# Altium project Al_robot.PrjPcb
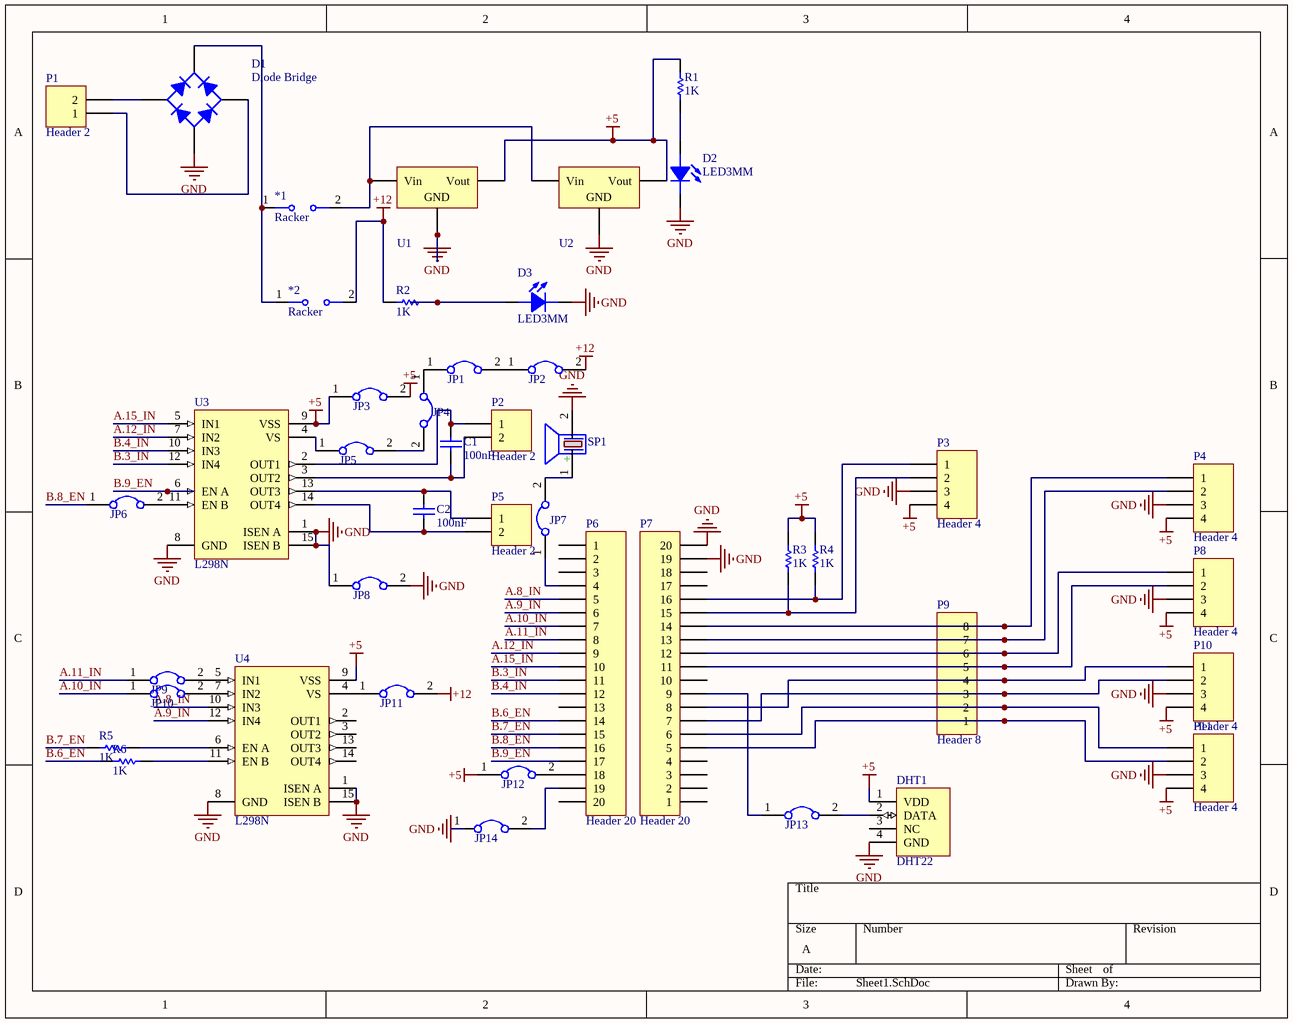
[diagram p0: Sheet1.SchDoc]
1 sheet, 44 parts. Net scope: global (net labels, ports and power ports of the same name join across sheets).
Board file: PCB1.PcbDoc

## Sheet Sheet1.SchDoc
size A; DocumentNumber: 1; SheetNumber: 1; SheetTotal: 1

### Parts
*1  Racker  [Racker 2 Pin]
*2  Racker  [Racker 2 Pin]
C1  100nF  [Cap-100nF]
C2  100nF  [Cap-100nF]
D1  Diode Bridge  [Bridge KBL PACKAGE]
D2  LED3MM  [LED3mm_GRN]
D3  LED3MM  [LED3mm_GRN]
DHT1  DHT22  [DHT22]
JP1  Jumper  [Jumper]  (value not drawn)
JP2  Jumper  [Jumper]  (value not drawn)
JP3  Jumper  [Jumper]  (value not drawn)
JP4  Jumper  [Jumper]  (value not drawn)
JP5  Jumper  [Jumper]  (value not drawn)
JP6  Jumper  [Jumper]  (value not drawn)
JP7  Jumper  [Jumper]  (value not drawn)
JP8  Jumper  [Jumper]  (value not drawn)
JP9  Jumper  [Jumper]  (value not drawn)
JP10  Jumper  [Jumper]  (value not drawn)
JP11  Jumper  [Jumper]  (value not drawn)
JP12  Jumper  [Jumper]  (value not drawn)
JP13  Jumper  [Jumper]  (value not drawn)
JP14  Jumper  [Jumper]  (value not drawn)
P1  Header 2  [HDR1X2]
P2  Header 2  [HDR1X2]
P3  Header 4  [HDR1X4]
P4  Header 4  [HDR1X4]
P5  Header 2  [HDR1X2]
P6  Header 20  [HDR1X20]
P7  Header 20  [HDR1X20]
P8  Header 4  [HDR1X4]
P9  Header 8  [HDR1X8]
P10  Header 4  [HDR1X4]
P11  Header 4  [HDR1X4]
R1  1K  [RES-(1/4)]
R2  1K  [RES-(1/4)]
R3  1K  [RES-(1/4)]
R4  1K  [RES-(1/4)]
R5  1K  [RES-(1/4)]
R6  1K  [RES-(1/4)]
SP1  (no value)  [BUZZER 7.62mm DC]
U1  L7805CV  [TO-220 AB]  (value not drawn)
U2  L7805CV  [TO-220 AB]  (value not drawn)
U3  L298N  [Multiwatt15V]
U4  L298N  [Multiwatt15V]

### Nets
+5: DHT1.1(VDD) JP3.1 JP3.2 JP12.1 P3.4 P4.4 P8.4 P10.4 P11.4 R1.2 R3.2 R4.2 U1.3(Vout) U2.3(Vout) U3.9(VSS) U4.9(VSS)
+12: *2.2 JP2.2 JP11.2 R2.2
GND: D1.4(-) D2.2(CATHODE) D3.2(CATHODE) DHT1.4(GND) JP8.1 JP8.2 JP14.1 P3.3 P4.3 P7.19 P7.20 P8.3 P10.3 P11.3 SP1.2(-) U1.2(GND) U2.2(GND) U3.1(ISEN_A) U3.8(GND) U3.15(ISEN_B) U4.1(ISEN_A) U4.8(GND) U4.15(ISEN_B)
A.8_IN: P6.5 U4.10(IN3)
A.9_IN: P6.6 U4.12(IN4)
A.10_IN: JP10.1 P6.7
A.11_IN: JP9.1 P6.8
A.12_IN: P6.9 U3.7(IN2)
A.15_IN: P6.10 U3.5(IN1)
B.3_IN: P6.11 U3.12(IN4)
B.4_IN: P6.12 U3.10(IN3)
B.6_EN: P6.14 R6.1
B.7_EN: P6.15 R5.1
B.8_EN: JP6.1 P6.16
B.9_EN: P6.17 U3.6(EN_A)
Net*1_1: *1.1(Button) *2.1(Button) D1.1(+)
Net*1_2: *1.2 U1.1(Vin) U2.1(Vin)
NetC1_1: C1.1 P2.2 U3.3(OUT2)
NetC1_2: C1.2 P2.1 U3.2(OUT1)
NetC2_1: C2.1 P5.2 U3.14(OUT4)
NetC2_2: C2.2 P5.1 U3.13(OUT3)
NetD1_2: D1.2(AC) P1.2
NetD1_3: D1.3(AC) P1.1
NetD2_1: D2.1(ANODE) R1.1
NetD3_1: D3.1(ANODE) R2.1
NetDHT1_2: DHT1.2(DATA) JP13.2
NetJP1_1: JP1.1 JP4.1
NetJP1_2: JP1.2 JP2.1
NetJP4_2: JP4.2 JP5.2
NetJP5_1: JP5.1 U3.4(VS)
NetJP6_2: JP6.2 U3.11(EN_B)
NetJP7_1: JP7.1 P6.4
NetJP7_2: JP7.2 SP1.1(+)
NetJP9_2: JP9.2 U4.5(IN1)
NetJP10_2: JP10.2 U4.7(IN2)
NetJP11_1: JP11.1 U4.4(VS)
NetJP12_2: JP12.2 P6.18
NetJP13_1: JP13.1 P7.9
NetJP14_2: JP14.2 P6.19
NetP3_1: P3.1 P7.16 R4.1
NetP3_2: P3.2 P7.15 R3.1
NetP4_1: P4.1 P7.14 P9.8
NetP4_2: P4.2 P7.13 P9.7
NetP7_5: P7.5 P9.1 P11.2
NetP7_6: P7.6 P9.2 P11.1
NetP7_7: P7.7 P9.3 P10.2
NetP7_8: P7.8 P9.4 P10.1
NetP7_11: P7.11 P8.2 P9.5
NetP7_12: P7.12 P8.1 P9.6
NetR5_2: R5.2 U4.6(EN_A)
NetR6_2: R6.2 U4.11(EN_B)

Not connected (* = marked no-connect by the designer): DHT1 3(NC); P6 1 2 3 13 20; P7 1 2 3 4 10 17 18; U4 2(OUT1) 3(OUT2) 13(OUT3) 14(OUT4)

### Library data of the parts
C1 C2 = CAP CERAMIC TOTAL SIZE: CAP Ceramic Total; Designer: Ali Hafizi
D1 = Diode Bridge TOTAL SIZE: Full Wave Diode Bridge; Designer: Abbas Basereh; Design Date: 1395/11/09; ComponentLink1Description: Datasheet; ComponentLink2Description: Reference; Mounting Technology: Surface Mount\Through-Hole; Status: Unreleased
D2 D3 = LED 3MM: Light Emitting Diode; Designer: Ali Hafizi
DHT1 = DHT22: Digital Humidity & Temprature Sensor
JP1-JP14 = Jumper: Company: E.P.I.L; Defualt State: Close; Design Date: 2011/11/02
P1 P2 P5 = Header 2: Header, 2-Pin; LatestRevisionDate: 17-Jul-2002; LatestRevisionNote: Re-released for DXP Platform.; Publisher: Altium Limited
P3 P4 P8 P10 P11 = Header 4: Header, 4-Pin; LatestRevisionDate: 17-Jul-2002; LatestRevisionNote: Re-released for DXP Platform.; Publisher: Altium Limited
P6 P7 = Header 20: Header, 20-Pin; LatestRevisionDate: 17-Jul-2002; LatestRevisionNote: Re-released for DXP Platform.; Publisher: Altium Limited
P9 = Header 8: Header, 8-Pin; LatestRevisionDate: 17-Jul-2002; LatestRevisionNote: Re-released for DXP Platform.; Publisher: Altium Limited
R1-R6 = RES DIP PACKAGE: TOTAL DIP RESISTOR PACK; Designer: Ali Hafizi
SP1 = PIEZO BUZZER: PIEZO BUZZER ACTIVE; Designer: Abbas Basereh; Comment_1: SPEAKER AND BEEP; Design Date: 1395/11/14; ComponentLink2Description: Reference; PackageDescription: THD; Publisher: Abbas Basereh; Mounting Technology: THD; Pin Count: 2; Status: Unreleased
U1 U2 = L7805CV-Linear Voltage Regulator IC Positive 1 Output 5V 1.5A TO-220AB: Linear Voltage Regulator IC Positive FIXED; Manufacturer: STMicroelectronics; Designer: Abbas Basereh; Link: https://www.aliexpress.com/item/; Link: http://www.tme.eu/en/; Link: http://www.digikey.com/; Part. No: L7805CV
U3 U4 = L298N: Dual Full Bridge Driver; Revision 1: 24-Aug-2001: Footprint Added.; Revision 2: 17-Jul-2002: Re-released for DXP Platform.; Package Information: Latest Revision: Apr-1998; Published: 8-Jun-2000; Datasheet: Latest Revision: Jul-1999; Package Reference: Multiwatt15H; Publisher: Altium Limited
*1 *2 = Racker: ComponentLink1Description: Website Smart World; ComponentLink1URL: https://www.smartw.ir/; ComponentLink2Description: Telegram; ComponentLink2URL: https://t.me/altium_smartw; ComponentLink3Description: Instagram; ComponentLink3URL: https://Instagram.com/smartgw.ir; DatasheetVersion: 2021